# Altium schematic sheet Quadrotor.SchDoc
size A; SheetNumber: 1
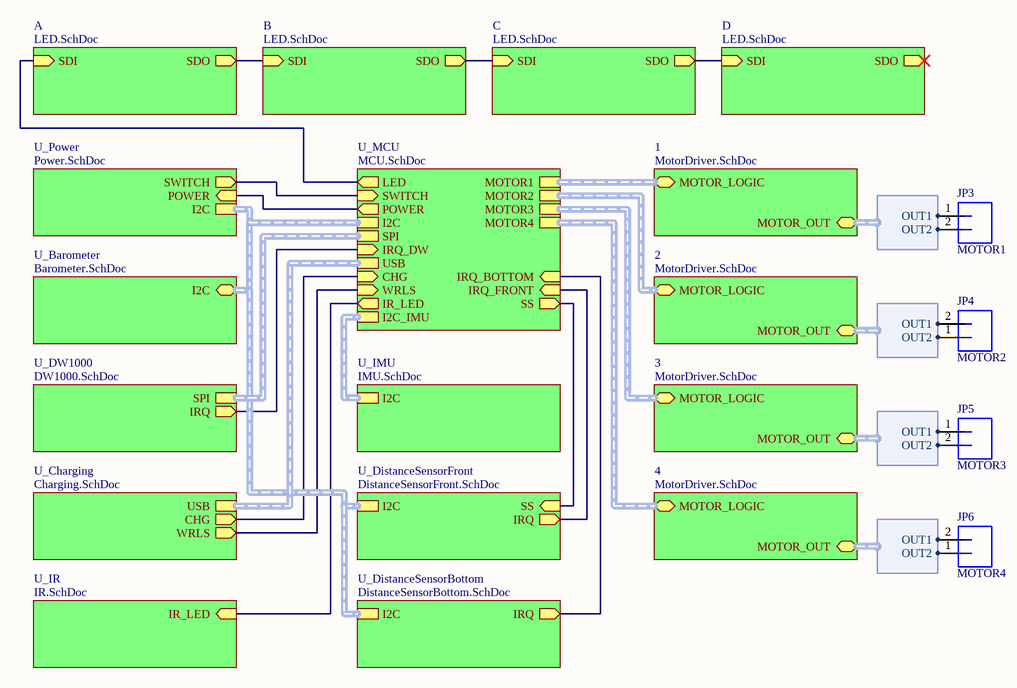
[diagram p0: Quadrotor.SchDoc]

## Parts
JP3  MOTOR1  [MOLEX-PICOBLADE-1.25MM-2-HORZ-SMD]
JP4  MOTOR2  [MOLEX-PICOBLADE-1.25MM-2-HORZ-SMD]
JP5  MOTOR3  [MOLEX-PICOBLADE-1.25MM-2-HORZ-SMD]
JP6  MOTOR4  [MOLEX-PICOBLADE-1.25MM-2-HORZ-SMD]

## Sub-sheets
1 = MotorDriver.SchDoc: MOTOR_LOGIC (harness Motor), MOTOR_OUT (harness MotorOutput)
2 = MotorDriver.SchDoc: MOTOR_LOGIC (harness Motor), MOTOR_OUT (harness MotorOutput)
3 = MotorDriver.SchDoc: MOTOR_LOGIC (harness Motor), MOTOR_OUT (harness MotorOutput)
4 = MotorDriver.SchDoc: MOTOR_LOGIC (harness Motor), MOTOR_OUT (harness MotorOutput)
A = LED.SchDoc: SDI (in), SDO (out)
B = LED.SchDoc: SDI (in), SDO (out)
C = LED.SchDoc: SDI (in), SDO (out)
D = LED.SchDoc: SDI (in), SDO (out)
U_Barometer = Barometer.SchDoc: I2C (harness I2C)
U_Charging = Charging.SchDoc: USB (harness USB), CHG (out), WRLS (out)
U_DistanceSensorBottom = DistanceSensorBottom.SchDoc: I2C (harness I2C), IRQ (out)
U_DistanceSensorFront = DistanceSensorFront.SchDoc: I2C (harness I2C), IRQ (out), SS (in)
U_DW1000 = DW1000.SchDoc: SPI (harness SPI), IRQ (out)
U_IMU = IMU.SchDoc: I2C (harness I2C)
U_IR = IR.SchDoc: IR_LED (in)
U_MCU = MCU.SchDoc: USB (harness USB), I2C (harness I2C), SPI (harness SPI), LED (out), CHG (in), I2C_IMU (harness I2C), SWITCH (in), POWER (out), MOTOR1 (harness Motor), MOTOR2 (harness Motor), MOTOR3 (harness Motor), MOTOR4 (harness Motor), SS (out), IRQ_FRONT (in), WRLS (in), IR_LED (out), IRQ_BOTTOM (in), IRQ_DW (in)
U_Power = Power.SchDoc: SWITCH (out), POWER (in), I2C (harness I2C)

## Harnesses
MotorOutput: OUT1, OUT2

## Nets
NetJP3_1: JP3.1 ; sheet 1/MOTOR_OUT.OUT1
NetJP3_2: JP3.2 ; sheet 1/MOTOR_OUT.OUT2
NetJP4_1: JP4.1 ; sheet 2/MOTOR_OUT.OUT2
NetJP4_2: JP4.2 ; sheet 2/MOTOR_OUT.OUT1
NetJP5_1: JP5.1 ; sheet 3/MOTOR_OUT.OUT1
NetJP5_2: JP5.2 ; sheet 3/MOTOR_OUT.OUT2
NetJP6_1: JP6.1 ; sheet 4/MOTOR_OUT.OUT2
NetJP6_2: JP6.2 ; sheet 4/MOTOR_OUT.OUT1
(unnamed): sheet A/SDI, sheet U_MCU/LED
(unnamed): sheet A/SDO, sheet B/SDI
(unnamed): sheet D/SDI, sheet C/SDO
(unnamed): sheet B/SDO, sheet C/SDI
(unnamed): sheet U_DistanceSensorFront/IRQ, sheet U_MCU/IRQ_FRONT
(unnamed): sheet U_DistanceSensorFront/SS, sheet U_MCU/SS
(unnamed): sheet U_MCU/CHG, sheet U_Charging/CHG
(unnamed): sheet U_MCU/SWITCH, sheet U_Power/SWITCH
(unnamed): sheet U_MCU/POWER, sheet U_Power/POWER
(unnamed): sheet U_MCU/WRLS, sheet U_Charging/WRLS
(unnamed): sheet U_MCU/IR_LED, sheet U_IR/IR_LED
(unnamed): sheet U_MCU/IRQ_BOTTOM, sheet U_DistanceSensorBottom/IRQ
(unnamed): sheet U_MCU/IRQ_DW, sheet U_DW1000/IRQ

## Buses and harness runs
harness sheet 1/MOTOR_LOGIC = sheet U_MCU/MOTOR1
harness sheet 2/MOTOR_LOGIC = sheet U_MCU/MOTOR2
harness sheet 3/MOTOR_LOGIC = sheet U_MCU/MOTOR3
harness sheet 4/MOTOR_LOGIC = sheet U_MCU/MOTOR4
harness sheet U_Barometer/I2C = sheet U_DistanceSensorBottom/I2C = sheet U_DistanceSensorFront/I2C = sheet U_MCU/I2C = sheet U_Power/I2C
harness sheet U_Charging/USB = sheet U_MCU/USB
harness sheet U_DW1000/SPI = sheet U_MCU/SPI
harness sheet U_IMU/I2C = sheet U_MCU/I2C_IMU

## Library data of the parts
JP3-JP6 = MOLEX_PICOBLADE_1.25MM_2_HORZ_SMD: Manufacturer: Molex; PartNumber: 53261-0271; Mounting Technology: Surface Mount; PackageReference: PicoBlade-1.25mm